# Altium project giao-dong-led.PrjPCB
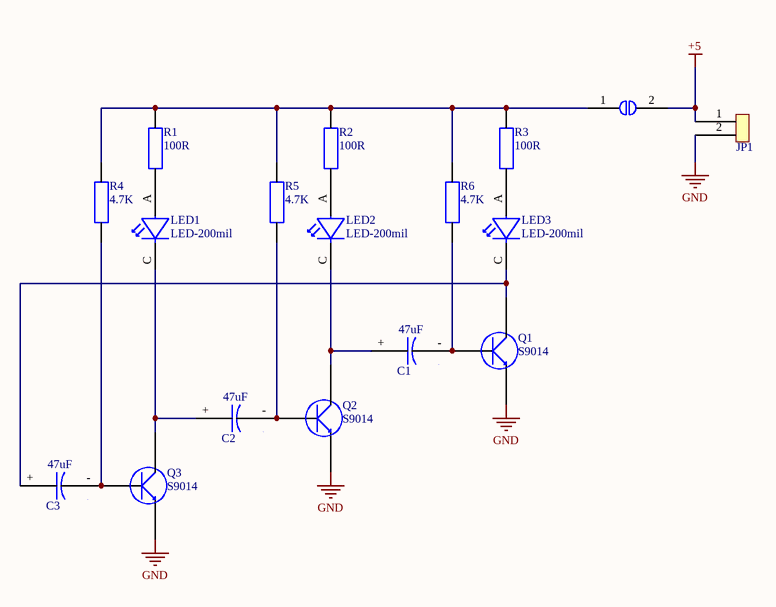
[diagram p0: giao-dong-led.SchDoc]
1 sheet, 17 parts. Net scope: global (net labels, ports and power ports of the same name join across sheets).
Board file: giao-dong-led.PcbDoc

## Sheet giao-dong-led.SchDoc
size Letter

### Parts
C1  47uF  [POL_250MIL_HORIZONTAL]
C2  47uF  [POL_250MIL_HORIZONTAL]
C3  47uF  [POL_250MIL_HORIZONTAL]
J1  Solderable Jump  [S_JP_3]  (value not drawn)
JP1  JP_2  [JP_2]  (value not drawn)
LED1  LED-200mil  [LED-200mil]
LED2  LED-200mil  [LED-200mil]
LED3  LED-200mil  [LED-200mil]
Q1  S9014  [S9014]
Q2  S9014  [S9014]
Q3  S9014  [S9014]
R1  100R  [RES]
R2  100R  [RES]
R3  100R  [RES]
R4  4.7K  [RES]
R5  4.7K  [RES]
R6  4.7K  [RES]

### Nets
+5: J1.2 JP1.1
GND: JP1.2 Q1.1 Q2.1 Q3.1
NetC1_+: C1.+ LED2.C Q2.3
NetC1_-: C1.- Q1.2 R6.1
NetC2_+: C2.+ LED1.C Q3.3
NetC2_-: C2.- Q2.2 R5.1
NetC3_+: C3.+ LED3.C Q1.3
NetC3_-: C3.- Q3.2 R4.1
NetJ1_1: J1.1 R1.2 R2.2 R3.2 R4.2 R5.2 R6.2
NetLED1_A: LED1.A R1.1
NetLED2_A: LED2.A R2.1
NetLED3_A: LED3.A R3.1

### Library data of the parts
C1-C3 = Pol-Cap: Tụ điện phân cực
R1-R6 = RES: điện trở size nhỏ